# Altium schematic sheet CurrentSensorInput.SchDoc
size 250 x 199 mm; SheetNumber: 5; SheetTotal: 7; Voltage: 16; ENG_APP_DATE: --/--/--; DSN_APP_DATE: --/--/--; CHK_APP_DATE: --/--/--
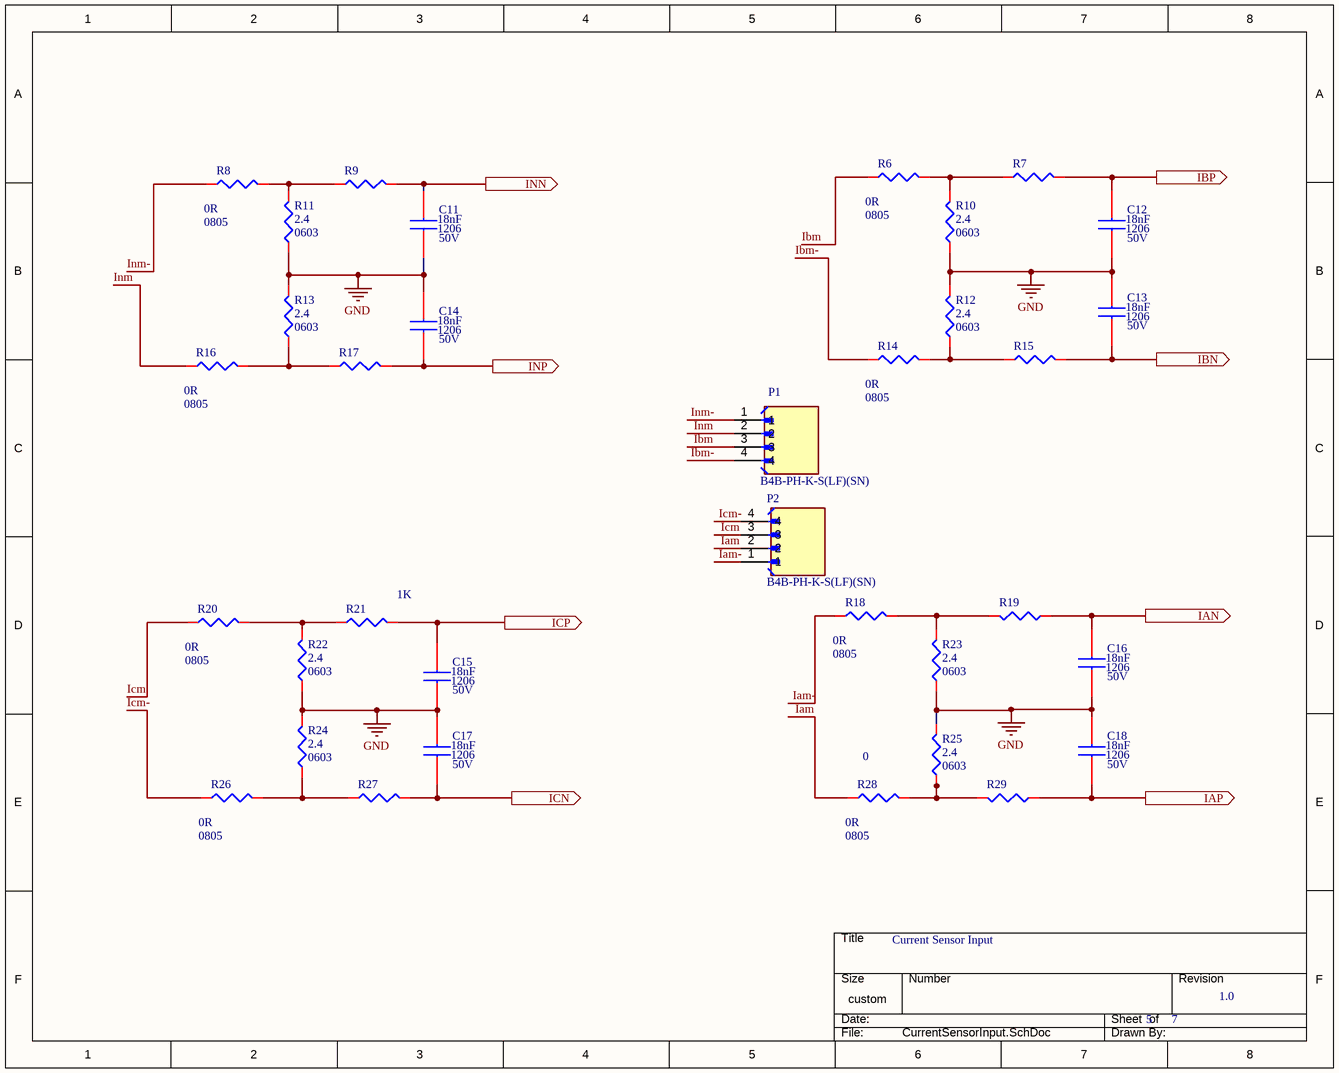
[diagram p0: CurrentSensorInput.SchDoc]

## Parts
C11  Size: 1206  Capacitance: 18nF  Voltage: 50V  [CAPC3316X180N]  (hidden comment: C1206C183J5RACTU)
C12  Size: 1206  Capacitance: 18nF  Voltage: 50V  [CAPC3316X180N]  (hidden comment: C1206C183J5RACTU)
C13  Size: 1206  Capacitance: 18nF  Voltage: 50V  [CAPC3316X180N]  (hidden comment: C1206C183J5RACTU)
C14  Size: 1206  Capacitance: 18nF  Voltage: 50V  [CAPC3316X180N]  (hidden comment: C1206C183J5RACTU)
C15  Size: 1206  Capacitance: 18nF  Voltage: 50V  [CAPC3316X180N]  (hidden comment: C1206C183J5RACTU)
C16  Size: 1206  Capacitance: 18nF  Voltage: 50V  [CAPC3316X180N]  (hidden comment: C1206C183J5RACTU)
C17  Size: 1206  Capacitance: 18nF  Voltage: 50V  [CAPC3316X180N]  (hidden comment: C1206C183J5RACTU)
C18  Size: 1206  Capacitance: 18nF  Voltage: 50V  [CAPC3316X180N]  (hidden comment: C1206C183J5RACTU)
P1  B4B-PH-K-S(LF)(SN)  [JST_B4B-PH-K-S(LF)(SN)]
P2  B4B-PH-K-S(LF)(SN)  [JST_B4B-PH-K-S(LF)(SN)]
R6  Resistance: 0R  Size: 0805  [RESC2013X84N]  (hidden comment: WSL080500000ZEA9)
R7  ERA-6AED102V  [RESC2013X84N]  (value not drawn)
R8  Resistance: 0R  Size: 0805  [RESC2013X84N]  (hidden comment: WSL080500000ZEA9)
R9  ERA-6AED102V  [RESC2013X84N]  (value not drawn)
R10  Resistance: 2.4  Size: 0603  [RESC1608X55N]  (hidden comment: CPF-A-0603B2K4E1)
R11  Resistance: 2.4  Size: 0603  [RESC1608X55N]  (hidden comment: CPF-A-0603B2K4E1)
R12  Resistance: 2.4  Size: 0603  [RESC1608X55N]  (hidden comment: CPF-A-0603B2K4E1)
R13  Resistance: 2.4  Size: 0603  [RESC1608X55N]  (hidden comment: CPF-A-0603B2K4E1)
R14  Resistance: 0R  Size: 0805  [RESC2013X84N]  (hidden comment: WSL080500000ZEA9)
R15  ERA-6AED102V  [RESC2013X84N]  (value not drawn)
R16  Resistance: 0R  Size: 0805  [RESC2013X84N]  (hidden comment: WSL080500000ZEA9)
R17  ERA-6AED102V  [RESC2013X84N]  (value not drawn)
R18  Resistance: 0R  Size: 0805  [RESC2013X84N]  (hidden comment: WSL080500000ZEA9)
R19  ERA-6AED102V  [RESC2013X84N]  (value not drawn)
R20  Resistance: 0R  Size: 0805  [RESC2013X84N]  (hidden comment: WSL080500000ZEA9)
R21  ERA-6AED102V  [RESC2013X84N]  (value not drawn)
R22  Resistance: 2.4  Size: 0603  [RESC1608X55N]  (hidden comment: CPF-A-0603B2K4E1)
R23  Resistance: 2.4  Size: 0603  [RESC1608X55N]  (hidden comment: CPF-A-0603B2K4E1)
R24  Resistance: 2.4  Size: 0603  [RESC1608X55N]  (hidden comment: CPF-A-0603B2K4E1)
R25  Resistance: 2.4  Size: 0603  [RESC1608X55N]  (hidden comment: CPF-A-0603B2K4E1)
R26  Resistance: 0R  Size: 0805  [RESC2013X84N]  (hidden comment: WSL080500000ZEA9)
R27  ERA-6AED102V  [RESC2013X84N]  (value not drawn)
R28  Resistance: 0R  Size: 0805  [RESC2013X84N]  (hidden comment: WSL080500000ZEA9)
R29  ERA-6AED102V  [RESC2013X84N]  (value not drawn)

## Ports
IAN (out, see Main[2C]), IAP (out, see Main[2C]), IBN (out, see Main[2C]), IBP (out, see Main[2C]), ICN (out, see Main[2C], MeteringIC[5D]), ICP (out, see Main[2C], MeteringIC[5D]), INN (out, see Main[2C], MeteringIC[5D]), INP (out, see Main[2C], MeteringIC[5D])

## Nets
GND: C11.2 C12.2 C13.1 C14.1 C15.2 C16.2 C17.1 C18.1 R10.2 R11.2 R12.1 R13.1 R22.2 R23.2 R24.1 R25.1
Iam: P2.2 R28.2
Iam-: P2.1 R18.2
IAN: C16.1 R19.2 ; port IAN
IAP: C18.2 R29.2 ; port IAP
Ibm: P1.3 R6.2
Ibm-: P1.4 R14.2
IBN: C13.2 R15.1 ; port IBN
IBP: C12.1 R7.1 ; port IBP
Icm: P2.3 R20.2
Icm-: P2.4 R26.2
ICN: C17.2 R27.1 ; port ICN
ICP: C15.1 R21.1 ; port ICP
Inm: P1.2 R16.2
Inm-: P1.1 R8.2
INN: C11.1 R9.1 ; port INN
INP: C14.2 R17.1 ; port INP
NetR6_1: R6.1 R7.2 R10.1
NetR8_1: R8.1 R9.2 R11.1
NetR12_2: R12.2 R14.1 R15.2
NetR13_2: R13.2 R16.1 R17.2
NetR18_1: R18.1 R19.1 R23.1
NetR20_1: R20.1 R21.2 R22.1
NetR24_2: R24.2 R26.1 R27.2
NetR25_2: R25.2 R28.1 R29.1

## Notes on the sheet
- (near R21) 1K
- (near R28) 0
- Current Sensor Input
- 5
- 7
- 1.0
- DWG. NO.
- REV.
- SHT.
- THIS DOCUMENT AND THE DATA DISCLOSED HEREIN OR HEREWITH IS THE PROPERTY OF ALTIUM LIMITED AND MAY BE FREELY DISTRIBUTED IN WHOLE. NO RIGHTS ARE RESERVED OR EXPRESS OR IMPLIED WARANTEE GIVEN.
- REVISION
- DESCRIPTION
- DATE
- APPROVED
- ENG:
- APPROVALS
- PROJECT
- DSN:
- CHK:
- REFERENCE DOCUMENTS
- PROJECT REVISION:
- TITLE
- DOCUMENT REVISION:
- DESIGN ITEM:
- BOM:
- FAB DWG:
- PCB DWG:
- ASSY DWG:
- SCALE:
- SIZE
- B
- CAGE CODE
- FILE NAME
- DWG NO.
- SHEET
- OF
- REV

## Library data of the parts
C11-C18 = C1206X224KARACAUTO: Multilayer Ceramic Capacitors MLCC - SMD/SMT 50V 0.018uF X7R 1206 5%; Manufacturer_Name: KEMET; Geometry.Height: 1.8mm; Mouser Part Number: 80-C1206X224KARAUTO; Mouser Price/Stock: https://www.mouser.co.uk/ProductDetail/KEMET/C1206X224KARACAUTO?qs=zW32dvEIR3ul9TqTUrs40g%3D%3D; Manufacturer_Part_Number: C1206X224KARACAUTO; Datasheet Link: https://search.kemet.com/component-documentation/download/specsheet/C1206X224KARACAUTO
P1 P2 = CMP-002-00071-1: Connector Header Through Hole 4 position 0.079 (2.00mm); MF: JST; Design Item ID: B4B-PH-K-S(LF)(SN); MP: B4B-PH-K-S(LF)(SN); Pins: 4; SnapEDA_Link: https://www.snapeda.com/parts/B4B-PH-K-S(LF)(SN)/JST/view-part/?ref=snap; Check_prices: https://www.snapeda.com/parts/B4B-PH-K-S(LF)(SN)/JST/view-part/?ref=eda; Component Type: Standard; Case/Package: None; Value: *; Source: B4B-PH-K-S(LF)(SN).SchLib
R6 R8 R14 R16 R18 R20 R26 R28 = WSL080500000ZEA9: VISHAY - WSL080500000ZEA9 - SMD Chip Resistor, Jumper, 0805 [2012 Metric], 0 ohm, WSL-9 Series, Metal Strip; Geometry.Height: 0.838mm; Mouser Part Number: 71-WSL080500000ZEA9; Mouser Price/Stock: https://www.mouser.co.uk/ProductDetail/Vishay-Dale/WSL080500000ZEA9?qs=f1l5vAGoKgsImKS87N8TmQ%3D%3D; Manufacturer_Name: Vishay; Manufacturer_Part_Number: WSL080500000ZEA9; Datasheet Link: https://ad.componentsearchengine.com/Datasheets/2/WSL080500000ZEA9.pdf
R7 R9 R15 R17 R19 R21 R27 R29 = ERA-6AED102V: Thin Film Resistors - SMD 0805 1000ohms 25ppm 0.5% AEC-Q200; Manufacturer_Name: Panasonic; Geometry.Height: 0.6mm; Mouser Part Number: 667-ERA-6AED102V; Mouser Price/Stock: https://www.mouser.co.uk/ProductDetail/Panasonic/ERA-6AED102V?qs=MNPzkKEzRtTAvKH%252BuMqwyg%3D%3D; Manufacturer_Part_Number: ERA-6AED102V; Datasheet Link: https://industrial.panasonic.com/cdbs/www-data/pdf/RDM0000/AOA0000C307.pdf
R10-R13 R22-R25 = WSL080500000ZEA9: Thick Film Resistors - SMD 2.4OHM 1% 1/2W 100PPM; Manufacturer_Name: Vishay; Geometry.Height: 0.838mm; Mouser Part Number: 71-WSL080500000ZEA9; Mouser Price/Stock: https://www.mouser.co.uk/ProductDetail/Vishay-Dale/WSL080500000ZEA9?qs=f1l5vAGoKgsImKS87N8TmQ%3D%3D; Manufacturer_Part_Number: WSL080500000ZEA9; Datasheet Link: https://ad.componentsearchengine.com/Datasheets/2/WSL080500000ZEA9.pdf